# Altium schematic sheet mix2_LO2.SchDoc
size A3
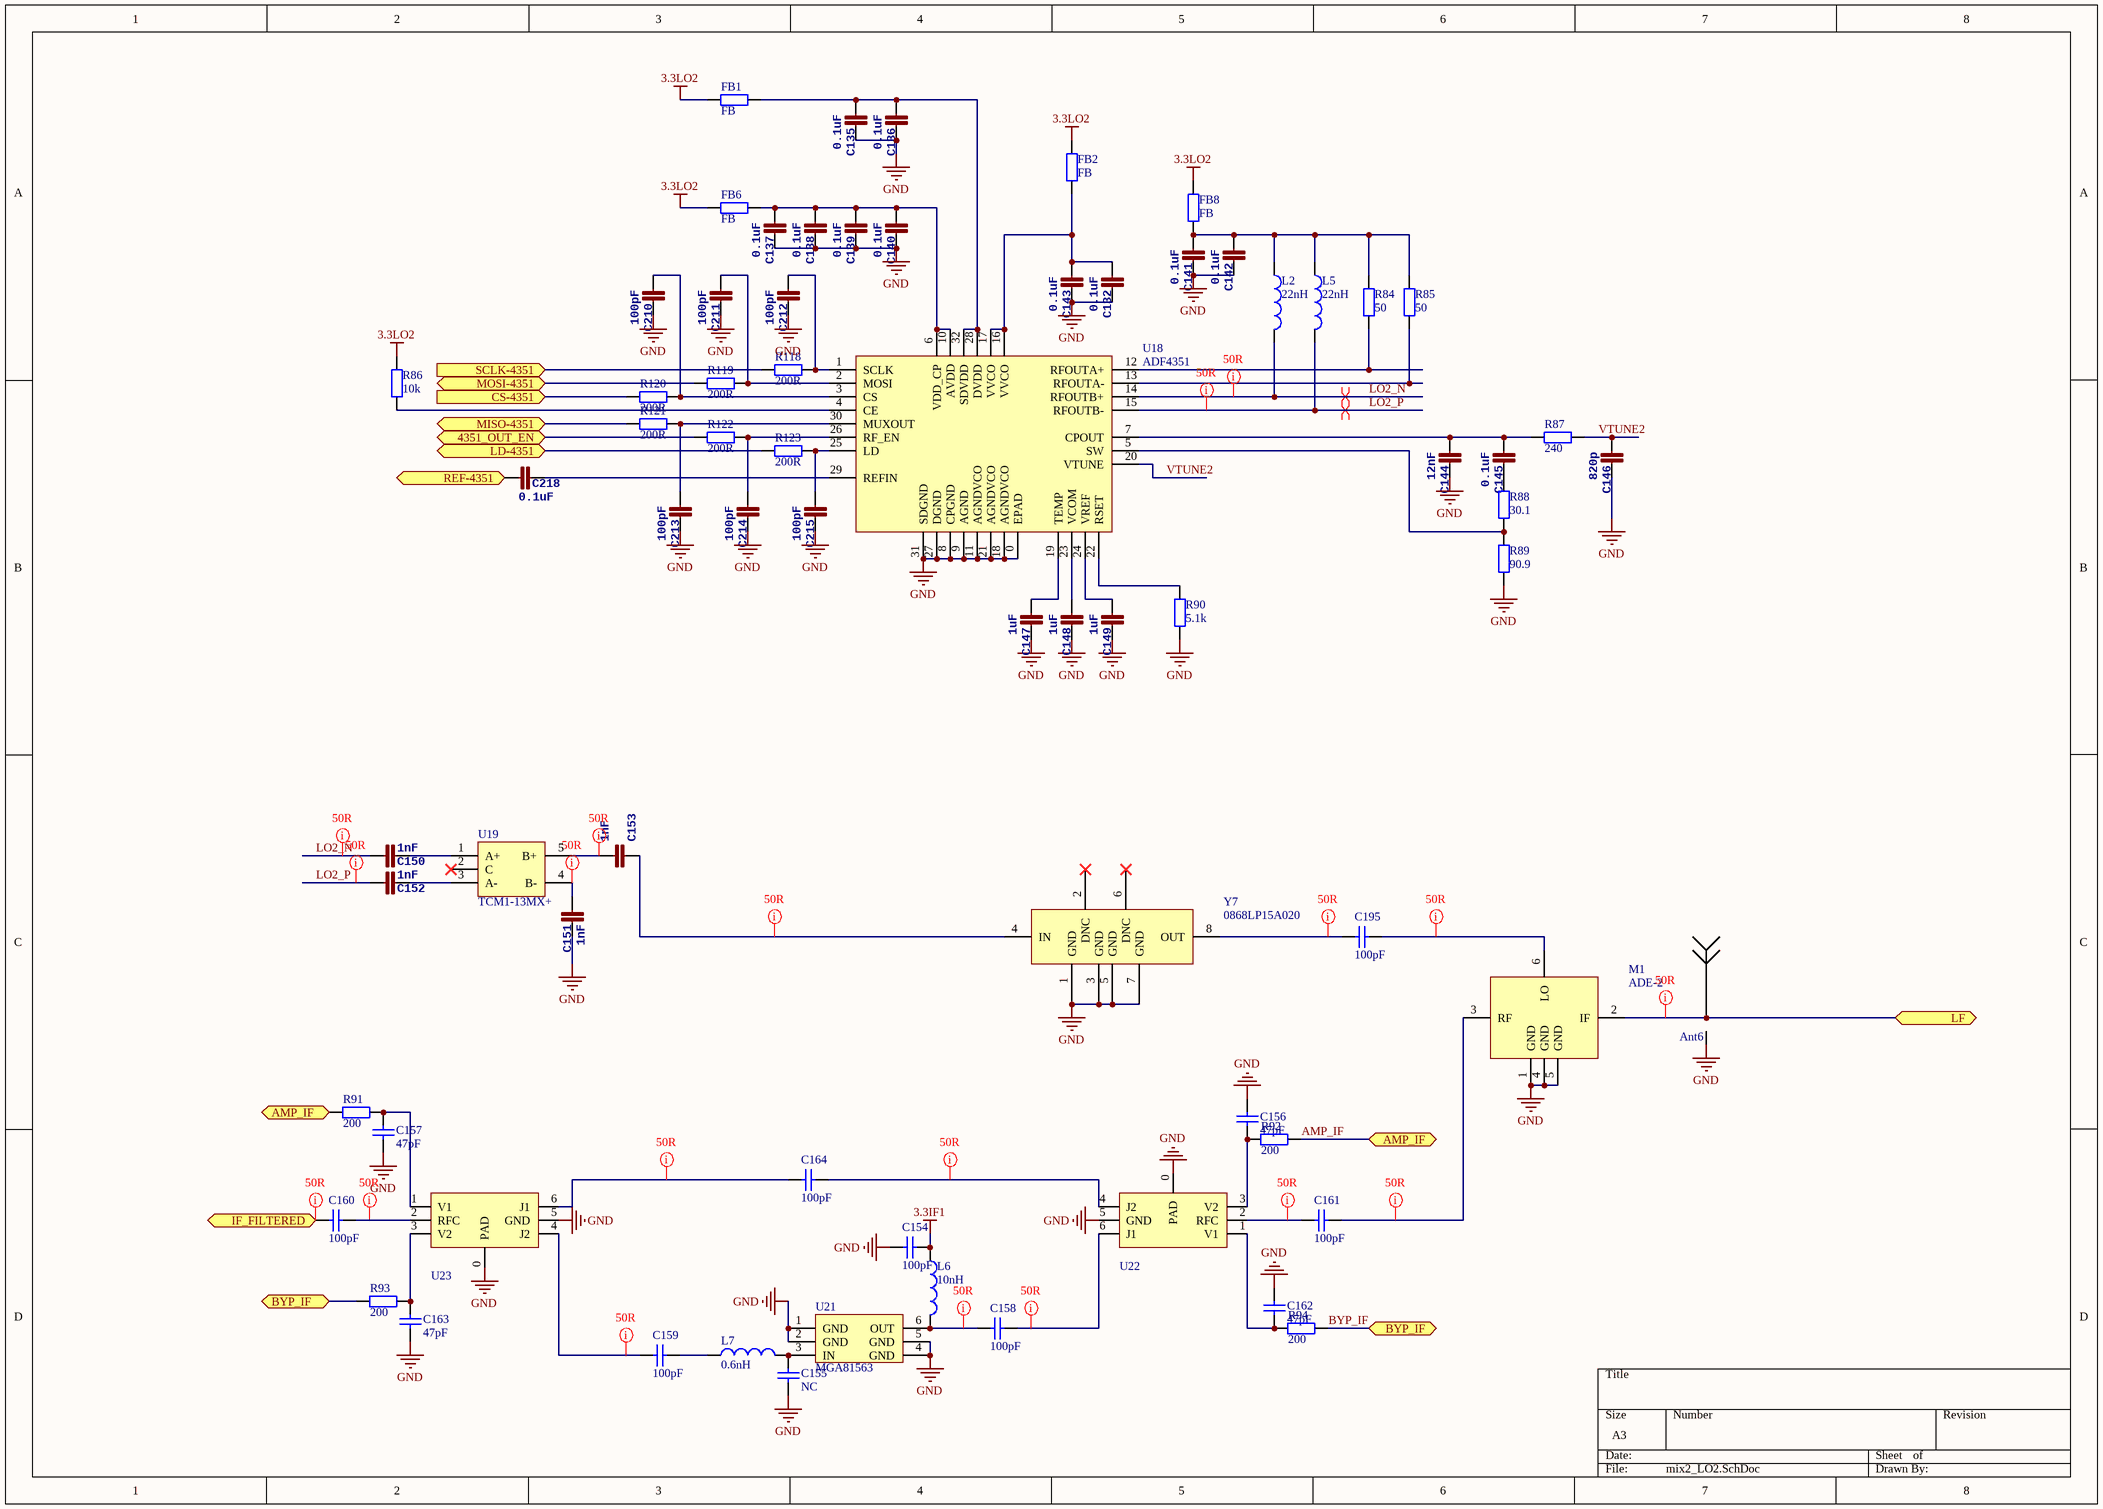
[diagram p0: mix2_LO2.SchDoc]

## Parts
Ant6  Antenna  [SMA-SMT]  (value not drawn)
C132  0.1uF  [0402]
C135  0.1uF  [0402]
C136  0.1uF  [0402]
C137  0.1uF  [0402]
C138  0.1uF  [0402]
C139  0.1uF  [0402]
C140  0.1uF  [0402]
C141  0.1uF  [0402]
C142  0.1uF  [0402]
C143  0.1uF  [0402]
C144  12nF  [0402]
C145  0.1uF  [0402]
C146  820p  [0402]
C147  1uF  [0402]
C148  1uF  [0402]
C149  1uF  [0402]
C150  1nF  [0402]
C151  1nF  [0402]
C152  1nF  [0402]
C153  1nF  [0402]
C154  value 100pF  [0402]  (hidden comment: Cap)
C155  value NC  [0402]  (hidden comment: Cap)
C156  47pF  [0402]
C157  47pF  [0402]
C158  value 100pF  [0402]  (hidden comment: Cap)
C159  value 100pF  [0402]  (hidden comment: Cap)
C160  100pF  [0402]
C161  100pF  [0402]
C162  47pF  [0402]
C163  47pF  [0402]
C164  value 100pF  [0402]  (hidden comment: Cap)
C195  100pF  [0402]
C210  100pF  [0402]
C211  100pF  [0402]
C212  100pF  [0402]
C213  100pF  [0402]
C214  100pF  [0402]
C215  100pF  [0402]
C218  0.1uF  [0402]
FB1  FB  [0603]
FB2  FB  [0603]
FB6  FB  [0603]
FB8  FB  [0603]
L2  value 22nH  [0402]  (hidden comment: Inductor)
L5  value 22nH  [0402]  (hidden comment: Inductor)
L6  value 10nH  [0603]  (hidden comment: Inductor)
L7  value 0.6nH  [0402]  (hidden comment: Inductor)
M1  ADE-2  [ADE-2]
R84  50  [0402]
R85  50  [0402]
R86  10k  [0402]
R87  240  [0402]
R88  30.1  [0402]
R89  90.9  [0402]
R90  5.1k  [0402]
R91  200  [0402]
R92  200  [0402]
R93  200  [0402]
R94  200  [0402]
R118  200R  [0402]
R119  200R  [0402]
R120  200R  [0402]
R121  200R  [0402]
R122  200R  [0402]
R123  200R  [0402]
U18  ADF4351  [ADF4351]
U19  TCM1-13MX+  [TCM-63AX+]
U21  MGA81563  [SC-70-6]
U22  SKY13320  [SKY65404-31]  (value not drawn)
U23  SKY13320  [SKY65404-31]  (value not drawn)
Y7  0868LP15A020  [5515LP15A730/0868LP15A020]

## Ports
4351_OUT_EN, AMP_IF, BYP_IF, CS-4351 (in), IF_FILTERED, LD-4351, LF, MISO-4351, MOSI-4351, REF-4351, SCLK-4351 (in)

## Nets
3.3IF1: C154.2 L6.1
3.3LO2: FB1.2 FB2.1 FB6.2 FB8.1 R86.2
GND: Ant6.GND(G) C132.2 C135.2 C136.2 C137.2 C138.2 C139.2 C140.2 C141.2 C142.2 C143.2 C144.2 C146.2 C147.2 C148.2 C149.2 C151.2 C154.1 C155.1 C156.1 C157.1 C162.1 C163.1 C210.2 C211.2 C212.2 C213.2 C214.2 C215.2 M1.1(GND) M1.4(GND) M1.5(GND) R89.1 R90.1 U18.0(EPAD) U18.8(CPGND) U18.9(AGND) U18.11(AGNDVCO) U18.18(AGNDVCO) U18.21(AGNDVCO) U18.27(DGND) U18.31(SDGND) U21.1(GND) U21.2(GND) U21.4(GND) U21.5(GND) U22.0(PAD) U22.5(GND) U23.0(PAD) U23.5(GND) Y7.1(GND) Y7.3(GND) Y7.5(GND) Y7.7(GND)
4351_OUT_EN: R122.2 ; port 4351_OUT_EN
AMP_IF: R91.1 R92.1 ; port AMP_IF
BYP_IF: R93.1 R94.1 ; port BYP_IF
CS-4351: R120.2 ; port CS-4351
IF_FILTERED: C160.2 ; port IF_FILTERED
LD-4351: R123.2 ; port LD-4351
LF: Ant6.1 M1.2(IF) ; port LF
LO2_N: C150.1 L2.2 U18.14(RFOUTB+)
LO2_P: C152.1 L5.2 U18.15(RFOUTB-)
MISO-4351: R121.2 ; port MISO-4351
MOSI-4351: R119.2 ; port MOSI-4351
REF-4351: C218.1 ; port REF-4351
SCLK-4351: R118.2 ; port SCLK-4351
VTUNE2: C146.1 R87.1 U18.20(VTUNE)
NetC132_1: C132.1 C143.1 FB2.2 U18.16(VVCO) U18.17(VVCO)
NetC135_1: C135.1 C136.1 FB1.1 U18.28(DVDD) U18.32(SDVDD)
NetC137_1: C137.1 C138.1 C139.1 C140.1 FB6.1 U18.6(VDD_CP) U18.10(AVDD)
NetC141_1: C141.1 C142.1 FB8.2 L2.1 L5.1 R84.1 R85.1
NetC144_1: C144.1 C145.1 R87.2 U18.7(CPOUT)
NetC145_2: C145.2 R88.2
NetC147_1: C147.1 U18.19(TEMP)
NetC148_1: C148.1 U18.23(VCOM)
NetC149_1: C149.1 U18.24(VREF)
NetC150_2: C150.2 U19.1(A+)
NetC151_1: C151.1 U19.4(B-)
NetC152_2: C152.2 U19.3(A-)
NetC153_1: C153.1 U19.5(B+)
NetC153_2: C153.2 Y7.4(IN)
NetC155_2: C155.2 L7.2 U21.3(IN)
NetC156_2: C156.2 R92.2 U22.3(V2)
NetC157_2: C157.2 R91.2 U23.1(V1)
NetC158_1: C158.1 L6.2 U21.6(OUT)
NetC158_2: C158.2 U22.6(J1)
NetC159_1: C159.1 U23.4(J2)
NetC159_2: C159.2 L7.1
NetC160_1: C160.1 U23.2(RFC)
NetC161_1: C161.1 U22.2(RFC)
NetC161_2: C161.2 M1.3(RF)
NetC162_2: C162.2 R94.2 U22.1(V1)
NetC163_2: C163.2 R93.2 U23.3(V2)
NetC164_1: C164.1 U23.6(J1)
NetC164_2: C164.2 U22.4(J2)
NetC195_1: C195.1 Y7.8(OUT)
NetC195_2: C195.2 M1.6(LO)
NetC210_1: C210.1 R120.1 U18.3(CS)
NetC211_1: C211.1 R119.1 U18.2(MOSI)
NetC212_1: C212.1 R118.1 U18.1(SCLK)
NetC213_1: C213.1 R121.1 U18.30(MUXOUT)
NetC214_1: C214.1 R122.1 U18.26(RF_EN)
NetC215_1: C215.1 R123.1 U18.25(LD)
NetC218_2: C218.2 U18.29(REFIN)
NetR84_2: R84.2 U18.12(RFOUTA+)
NetR85_2: R85.2 U18.13(RFOUTA-)
NetR86_1: R86.1 U18.4(CE)
NetR88_1: R88.1 R89.2 U18.5(SW)
NetR90_2: R90.2 U18.22(RSET)

Not connected (* = marked no-connect by the designer): U19 2(C)*; Y7 2(DNC)* 6(DNC)*

## Layout directives
differential pair: LO2_N, LO2_P
net class 50R: IF_FILTERED, LF, LO2_N, LO2_P, NetC151_1, NetC153_1, NetC153_2, NetC158_1, NetC158_2, NetC159_1, NetC160_1, NetC161_1, NetC161_2, NetC164_1, NetC164_2, NetC195_1, NetC195_2

## Library data of the parts
C132 C135-C153 C210-C215 C218 = CAP0402-CAP: <b>Capacitor</b> / Standard 0603 ceramic capacitor, and 0.1" leaded capacitor.; PARTNO: CC0402ZRY5V7BB104
C154-C164 C195 = Cap: Capacitor; Published: 8-Jun-2000; LatestRevisionDate: 17-Jul-2002; LatestRevisionNote: Re-released for DXP Platform.; PackageReference: RAD-0.3; Publisher: Altium Limited; PackageDescription: Radial Cap, Thru-Hole; 2 Leads; 0.3 in Pin Spacing
FB1 FB2 FB6 FB8 R84-R94 R118-R123 = Res2: Resistor; Published: 8-Jun-2000; LatestRevisionDate: 17-Jul-2002; LatestRevisionNote: Re-released for DXP Platform.; PackageReference: AXIAL-0.4; Publisher: Altium Limited; PackageDescription: Axial Device, Thru-Hole; 2 Leads; 0.4 in Pin Spacing
L2 L5-L7 = Inductor: Code_IEC: 1005; Published: 8-Jun-2000; LatestRevisionDate: 29-May-2009; LatestRevisionNote: IPC-7351 Footprint Added.; PackageReference: 0402-A; Publisher: Altium Limited; PackageDescription: Chip Inductor; Code_JEITA: 0402
U19 = TCM-63AX+
Y7 = 5515LP15A730/0868LP15A020